# Altium schematic sheet shudian_datapath.SchDoc
size A3; PageSetup: Record=PageOptions|CenterHorizontal=True|CenterVertical=True|PrintScale=0.73|XCorrection=1.00|YCorrection=1.00|PrintKind=0|BorderSize=5000000|LeftOffset=0|BottomOffset=0|Orientation=2|PaperLength=1000|PaperWidth=1000|Scale=100|PaperSource=7|PrintQuality=-4|MediaType=1|DitherType=10|PaperKind=A4|PrintScaleMode=1
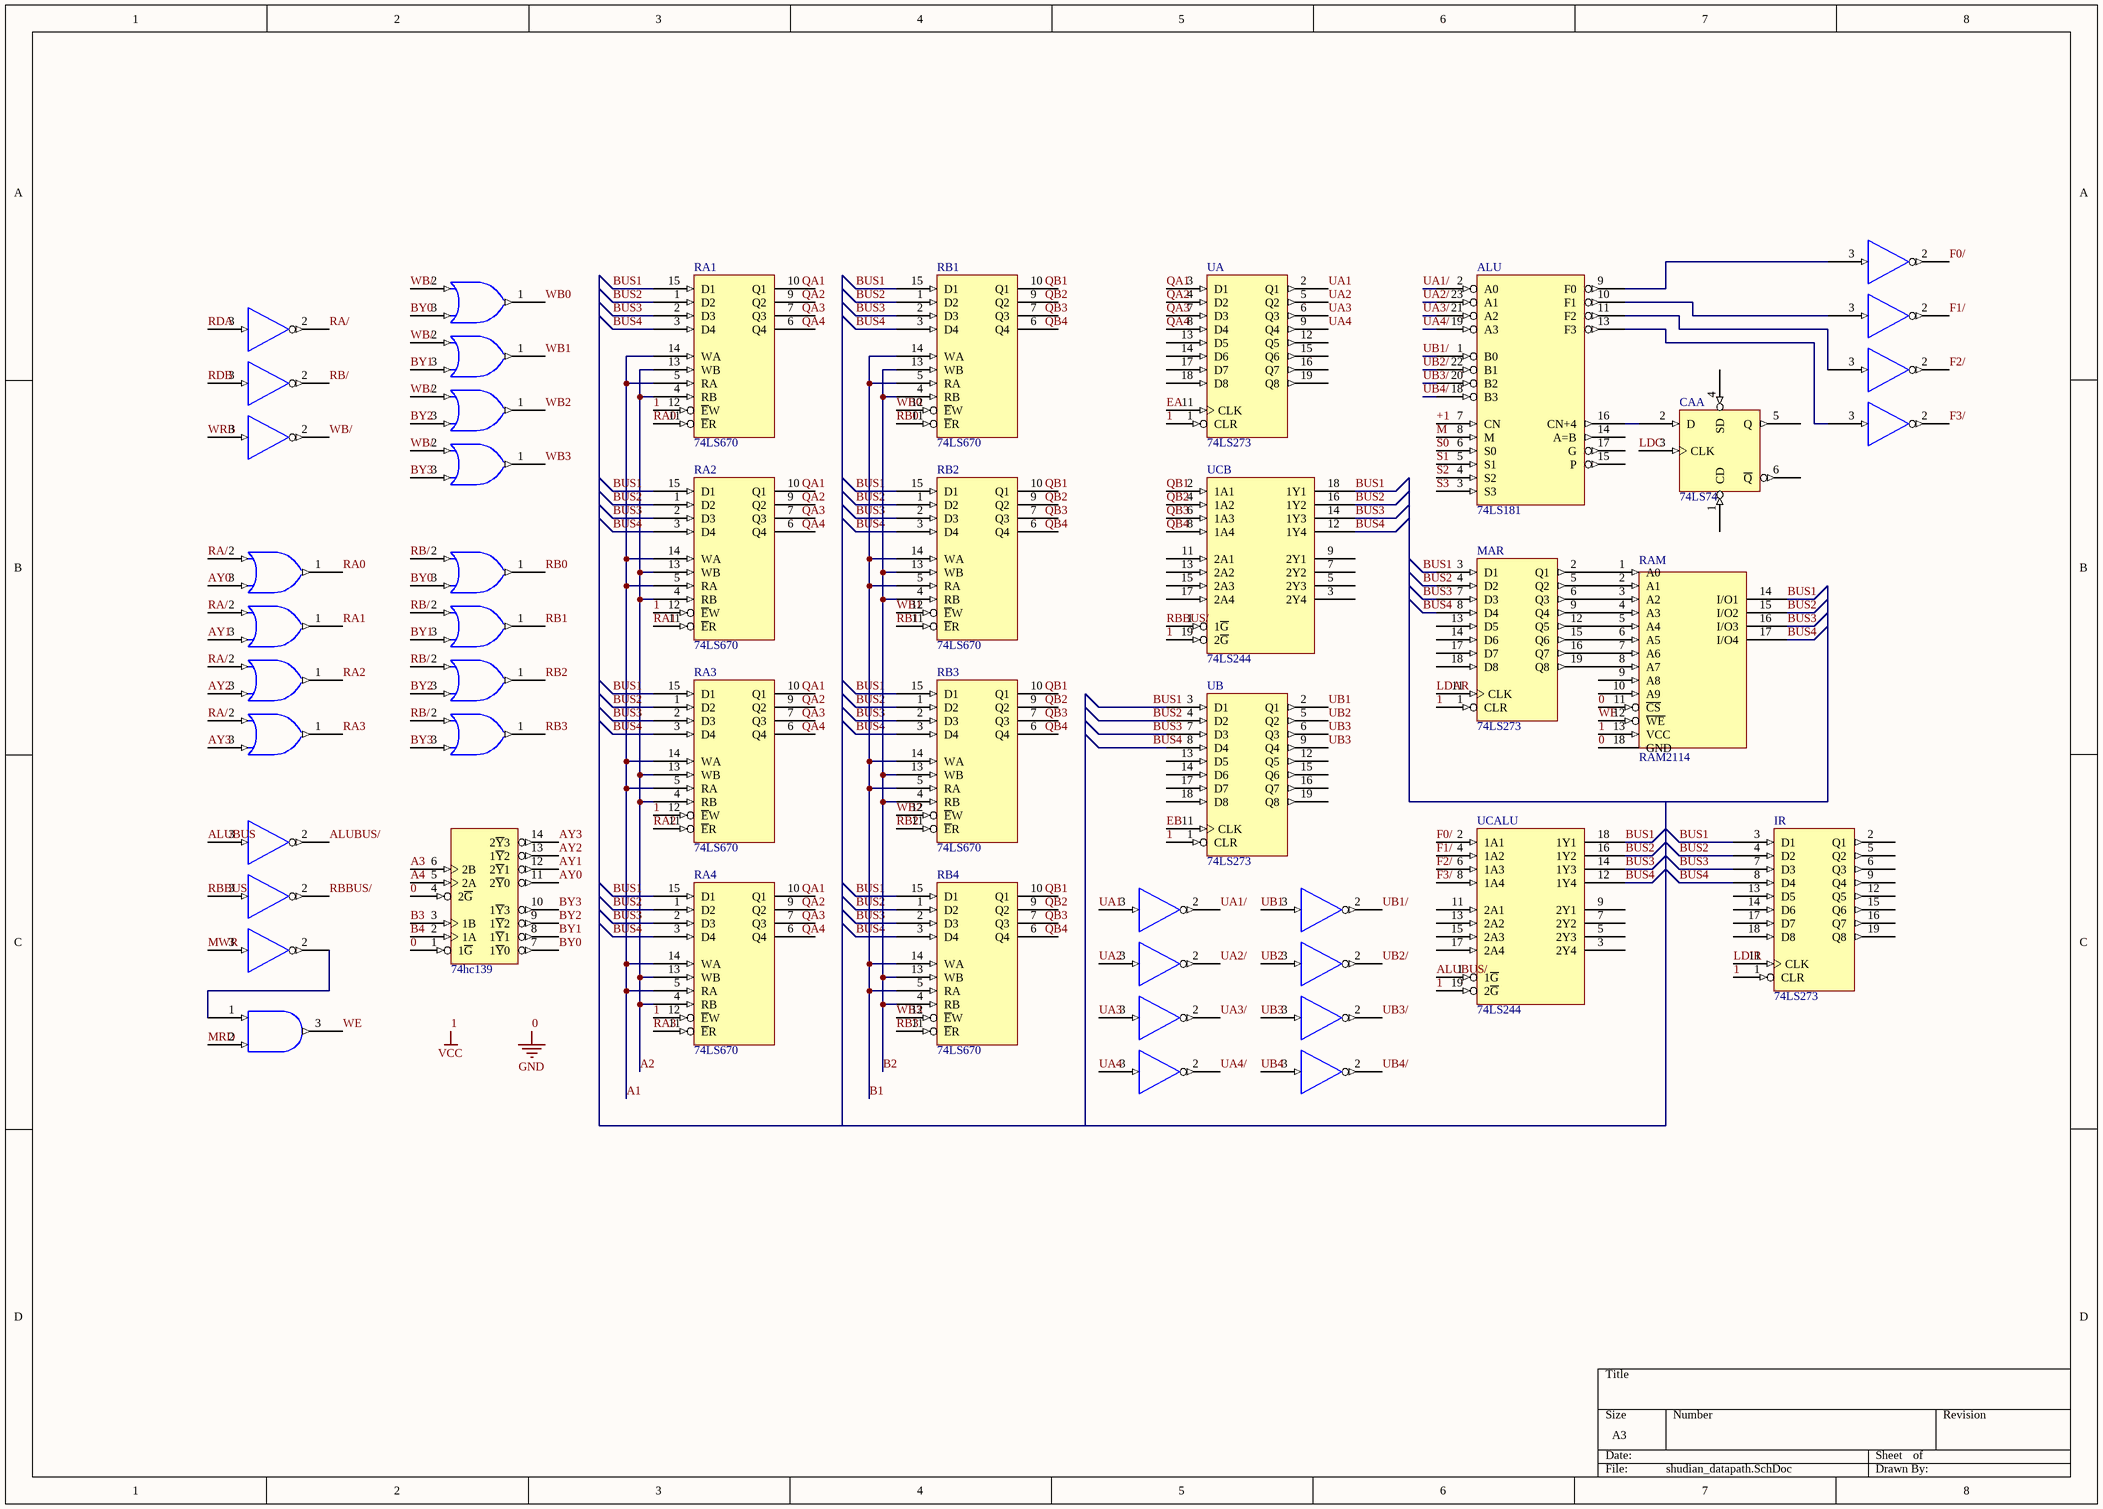
[diagram p0: shudian_datapath.SchDoc]

## Parts
*1  not  (value not drawn)
*2  not  (value not drawn)
*3  not  (value not drawn)
*4-2  74hc139
*21  and  (value not drawn)
*or5  or  (value not drawn)
ALU  74LS181  [DIP-24]
CA  74LS74  [DIP-14]  (part A of 2)
IR  74LS273  [DIP-20]
MAR  74LS273  [DIP-20]
not1  not  (value not drawn)
not2  not  (value not drawn)
not3  not  (value not drawn)
not4  not  (value not drawn)
not5  not  (value not drawn)
not6  not  (value not drawn)
not7  not  (value not drawn)
not8  not  (value not drawn)
not9  not  (value not drawn)
not10  not  (value not drawn)
not11  not  (value not drawn)
not12  not  (value not drawn)
not13  not  (value not drawn)
not14  not  (value not drawn)
not15  not  (value not drawn)
or1  or  (value not drawn)
or2  or  (value not drawn)
or3  or  (value not drawn)
or4  or  (value not drawn)
or6  or  (value not drawn)
or7  or  (value not drawn)
or8  or  (value not drawn)
or9  or  (value not drawn)
or10  or  (value not drawn)
or11  or  (value not drawn)
or12  or  (value not drawn)
RA1  74LS670  [DIP-16]
RA2  74LS670  [DIP-16]
RA3  74LS670  [DIP-16]
RA4  74LS670  [DIP-16]
RAM  RAM2114
RB1  74LS670  [DIP-16]
RB2  74LS670  [DIP-16]
RB3  74LS670  [DIP-16]
RB4  74LS670  [DIP-16]
UA  74LS273  [DIP-20]
UB  74LS273  [DIP-20]
UCALU  74LS244  [DIP-20]
UCB  74LS244  [DIP-20]

## Nets
0: *4-2.1(1~{G}) *4-2.4(2~{G}) ALU.12(GND) CA.7(GND) IR.10(GND) MAR.10(GND) RA1.8(GND) RA2.8(GND) RA3.8(GND) RA4.8(GND) RAM.11(~{CS}) RAM.18(GND) RB1.8(GND) RB2.8(GND) RB3.8(GND) RB4.8(GND) UA.10(GND) UB.10(GND) UCALU.10(GND) UCB.10(GND)  [also labelled GND]
1: ALU.24(VCC) CA.14(VCC) IR.1(CLR) IR.20(VCC) MAR.1(CLR) MAR.20(VCC) RA1.12(~{E}W) RA1.16(VCC) RA2.12(~{E}W) RA2.16(VCC) RA3.12(~{E}W) RA3.16(VCC) RA4.12(~{E}W) RA4.16(VCC) RAM.13(VCC) RB1.16(VCC) RB2.16(VCC) RB3.16(VCC) RB4.16(VCC) UA.1(CLR) UA.20(VCC) UB.1(CLR) UB.20(VCC) UCALU.19(2~{G}) UCALU.20(VCC) UCB.19(2~{G}) UCB.20(VCC)  [also labelled VCC]
+1: ALU.7(CN)
A1: RA1.5(RA) RA1.14(WA) RA2.5(RA) RA2.14(WA) RA3.5(RA) RA3.14(WA) RA4.5(RA) RA4.14(WA)
A2: RA1.4(RB) RA1.13(WB) RA2.4(RB) RA2.13(WB) RA3.4(RB) RA3.13(WB) RA4.4(RB) RA4.13(WB)
A3: *4-2.6(2B)
A4: *4-2.5(2A)
ALUBUS: *1.3
ALUBUS/: *1.2 UCALU.1(1~{G})
AY0: *4-2.11(2~{Y}0) or1.3
AY1: *4-2.12(2~{Y}1) or2.3
AY2: *4-2.13(1~{Y}2) or3.3
AY3: *4-2.14(2~{Y}3) or4.3
B1: RB1.5(RA) RB1.14(WA) RB2.5(RA) RB2.14(WA) RB3.5(RA) RB3.14(WA) RB4.5(RA) RB4.14(WA)
B2: RB1.4(RB) RB1.13(WB) RB2.4(RB) RB2.13(WB) RB3.4(RB) RB3.13(WB) RB4.4(RB) RB4.13(WB)
B3: *4-2.3(1B)
B4: *4-2.2(1A)
BUS1: IR.3(D1) MAR.3(D1) RA1.15(D1) RA2.15(D1) RA3.15(D1) RA4.15(D1) RAM.14(I/O1) RB1.15(D1) RB2.15(D1) RB3.15(D1) RB4.15(D1) UB.3(D1) UCALU.18(1Y1) UCB.18(1Y1)
BUS2: IR.4(D2) MAR.4(D2) RA1.1(D2) RA2.1(D2) RA3.1(D2) RA4.1(D2) RAM.15(I/O2) RB1.1(D2) RB2.1(D2) RB3.1(D2) RB4.1(D2) UB.4(D2) UCALU.16(1Y2) UCB.16(1Y2)
BUS3: IR.7(D3) MAR.7(D3) RA1.2(D3) RA2.2(D3) RA3.2(D3) RA4.2(D3) RAM.16(I/O3) RB1.2(D3) RB2.2(D3) RB3.2(D3) RB4.2(D3) UB.7(D3) UCALU.14(1Y3) UCB.14(1Y3)
BUS4: IR.8(D4) MAR.8(D4) RA1.3(D4) RA2.3(D4) RA3.3(D4) RA4.3(D4) RAM.17(I/O4) RB1.3(D4) RB2.3(D4) RB3.3(D4) RB4.3(D4) UB.8(D4) UCALU.12(1Y4) UCB.12(1Y4)
BY0: *4-2.7(1~{Y}0) *or5.3 or9.3
BY1: *4-2.8(1~{Y}1) or6.3 or10.3
BY2: *4-2.9(1~{Y}2) or7.3 or11.3
BY3: *4-2.10(1~{Y}3) or8.3 or12.3
EA: UA.11(CLK)
EB: UB.11(CLK)
F0/: not4.2 UCALU.2(1A1)
F1/: not5.2 UCALU.4(1A2)
F2/: not6.2 UCALU.6(1A3)
F3/: not7.2 UCALU.8(1A4)
LDAR: MAR.11(CLK)
LDC: CA.3(CLK)
LDIR: IR.11(CLK)
M: ALU.8(M)
MRD: *21.2
MWR: *3.3
QA1: UA.3(D1)
QA2: UA.4(D2)
QA3: UA.7(D3)
QA4: UA.8(D4)
QB1: UCB.2(1A1)
QB2: UCB.4(1A2)
QB3: UCB.6(1A3)
QB4: UCB.8(1A4)
RA0: or1.1 RA1.11(~{E}R)
RA1: or2.1 RA2.11(~{E}R)
RA2: or3.1 RA3.11(~{E}R)
RA3: or4.1 RA4.11(~{E}R)
RA/: not1.2 or1.2 or2.2 or3.2 or4.2
RB0: *or5.1 RB1.11(~{E}R)
RB1: or6.1 RB2.11(~{E}R)
RB2: or7.1 RB3.11(~{E}R)
RB3: or8.1 RB4.11(~{E}R)
RB/: *or5.2 not2.2 or6.2 or7.2 or8.2
RBBUS: *2.3
RBBUS/: *2.2 UCB.1(1~{G})
RDA: not1.3
RDB: not2.3
S0: ALU.6(S0)
S1: ALU.5(S1)
S2: ALU.4(S2)
S3: ALU.3(S3)
UA1: not8.3 UA.2(Q1)
UA1/: ALU.2(A0) not8.2
UA2: not9.3 UA.5(Q2)
UA2/: ALU.23(A1) not9.2
UA3: not10.3 UA.6(Q3)
UA3/: ALU.21(A2) not10.2
UA4: not11.3 UA.9(Q4)
UA4/: ALU.19(A3) not11.2
UB1: not12.3 UB.2(Q1)
UB1/: ALU.1(B0) not12.2
UB2: not13.3 UB.5(Q2)
UB2/: ALU.22(B1) not13.2
UB3: not14.3 UB.6(Q3) UB.9(Q4)
UB3/: ALU.20(B2) not14.2
UB4: not15.3
UB4/: ALU.18(B3) not15.2
WB0: or9.1 RB1.12(~{E}W)
WB1: or10.1 RB2.12(~{E}W)
WB2: or11.1 RB3.12(~{E}W)
WB3: or12.1 RB4.12(~{E}W)
WB/: not3.2 or9.2 or10.2 or11.2 or12.2
WE: *21.3 RAM.12(~{WE})
WRB: not3.3
Net*3_2: *3.2 *21.1
NetALU_9: ALU.9(F0) not4.3
NetALU_10: ALU.10(F1) not5.3
NetALU_11: ALU.11(F2) not6.3
NetALU_13: ALU.13(F3) not7.3
NetALU_16: ALU.16(CN+4) CA.2(D)
NetMAR_2: MAR.2(Q1) RAM.1(A0)
NetMAR_5: MAR.5(Q2) RAM.2(A1)
NetMAR_6: MAR.6(Q3) RAM.3(A2)
NetMAR_9: MAR.9(Q4) RAM.4(A3)
NetMAR_12: MAR.12(Q5) RAM.5(A4)
NetMAR_15: MAR.15(Q6) RAM.6(A5)
NetMAR_16: MAR.16(Q7) RAM.7(A6)
NetMAR_19: MAR.19(Q8) RAM.8(A7)

Not connected (* = marked no-connect by the designer): ALU 14(A=B) 15(P) 17(G); CA 1(CD) 4(SD) 5(Q) 6(~{Q}); IR 2(Q1) 5(Q2) 6(Q3) 9(Q4) 12(Q5) 13(D5) 14(D6) 15(Q6) 16(Q7) 17(D7) 18(D8) 19(Q8); MAR 13(D5) 14(D6) 17(D7) 18(D8); RA1 6(Q4) 7(Q3) 9(Q2) 10(Q1); RA2 6(Q4) 7(Q3) 9(Q2) 10(Q1); RA3 6(Q4) 7(Q3) 9(Q2) 10(Q1); RA4 6(Q4) 7(Q3) 9(Q2) 10(Q1); RAM 9(A8) 10(A9); RB1 6(Q4) 7(Q3) 9(Q2) 10(Q1); RB2 6(Q4) 7(Q3) 9(Q2) 10(Q1); RB3 6(Q4) 7(Q3) 9(Q2) 10(Q1); RB4 6(Q4) 7(Q3) 9(Q2) 10(Q1); UA 12(Q5) 13(D5) 14(D6) 15(Q6) 16(Q7) 17(D7) 18(D8) 19(Q8); UB 12(Q5) 13(D5) 14(D6) 15(Q6) 16(Q7) 17(D7) 18(D8) 19(Q8); UCALU 3(2Y4) 5(2Y3) 7(2Y2) 9(2Y1) 11(2A1) 13(2A2) 15(2A3) 17(2A4); UCB 3(2Y4) 5(2Y3) 7(2Y2) 9(2Y1) 11(2A1) 13(2A2) 15(2A3) 17(2A4)

## Notes on the sheet
- Labels drawn without touching a wire or pin: QA1, QA2, QA3, QA4, QB1, QB2, QB3, QB4